# EAGLE design Adafruit SPI Flash SD Card (EAGLE 9.6.2)
COMPANY: Adafruit Industries; DRAWN: KTOWN; REV: A; YEAR: 2018
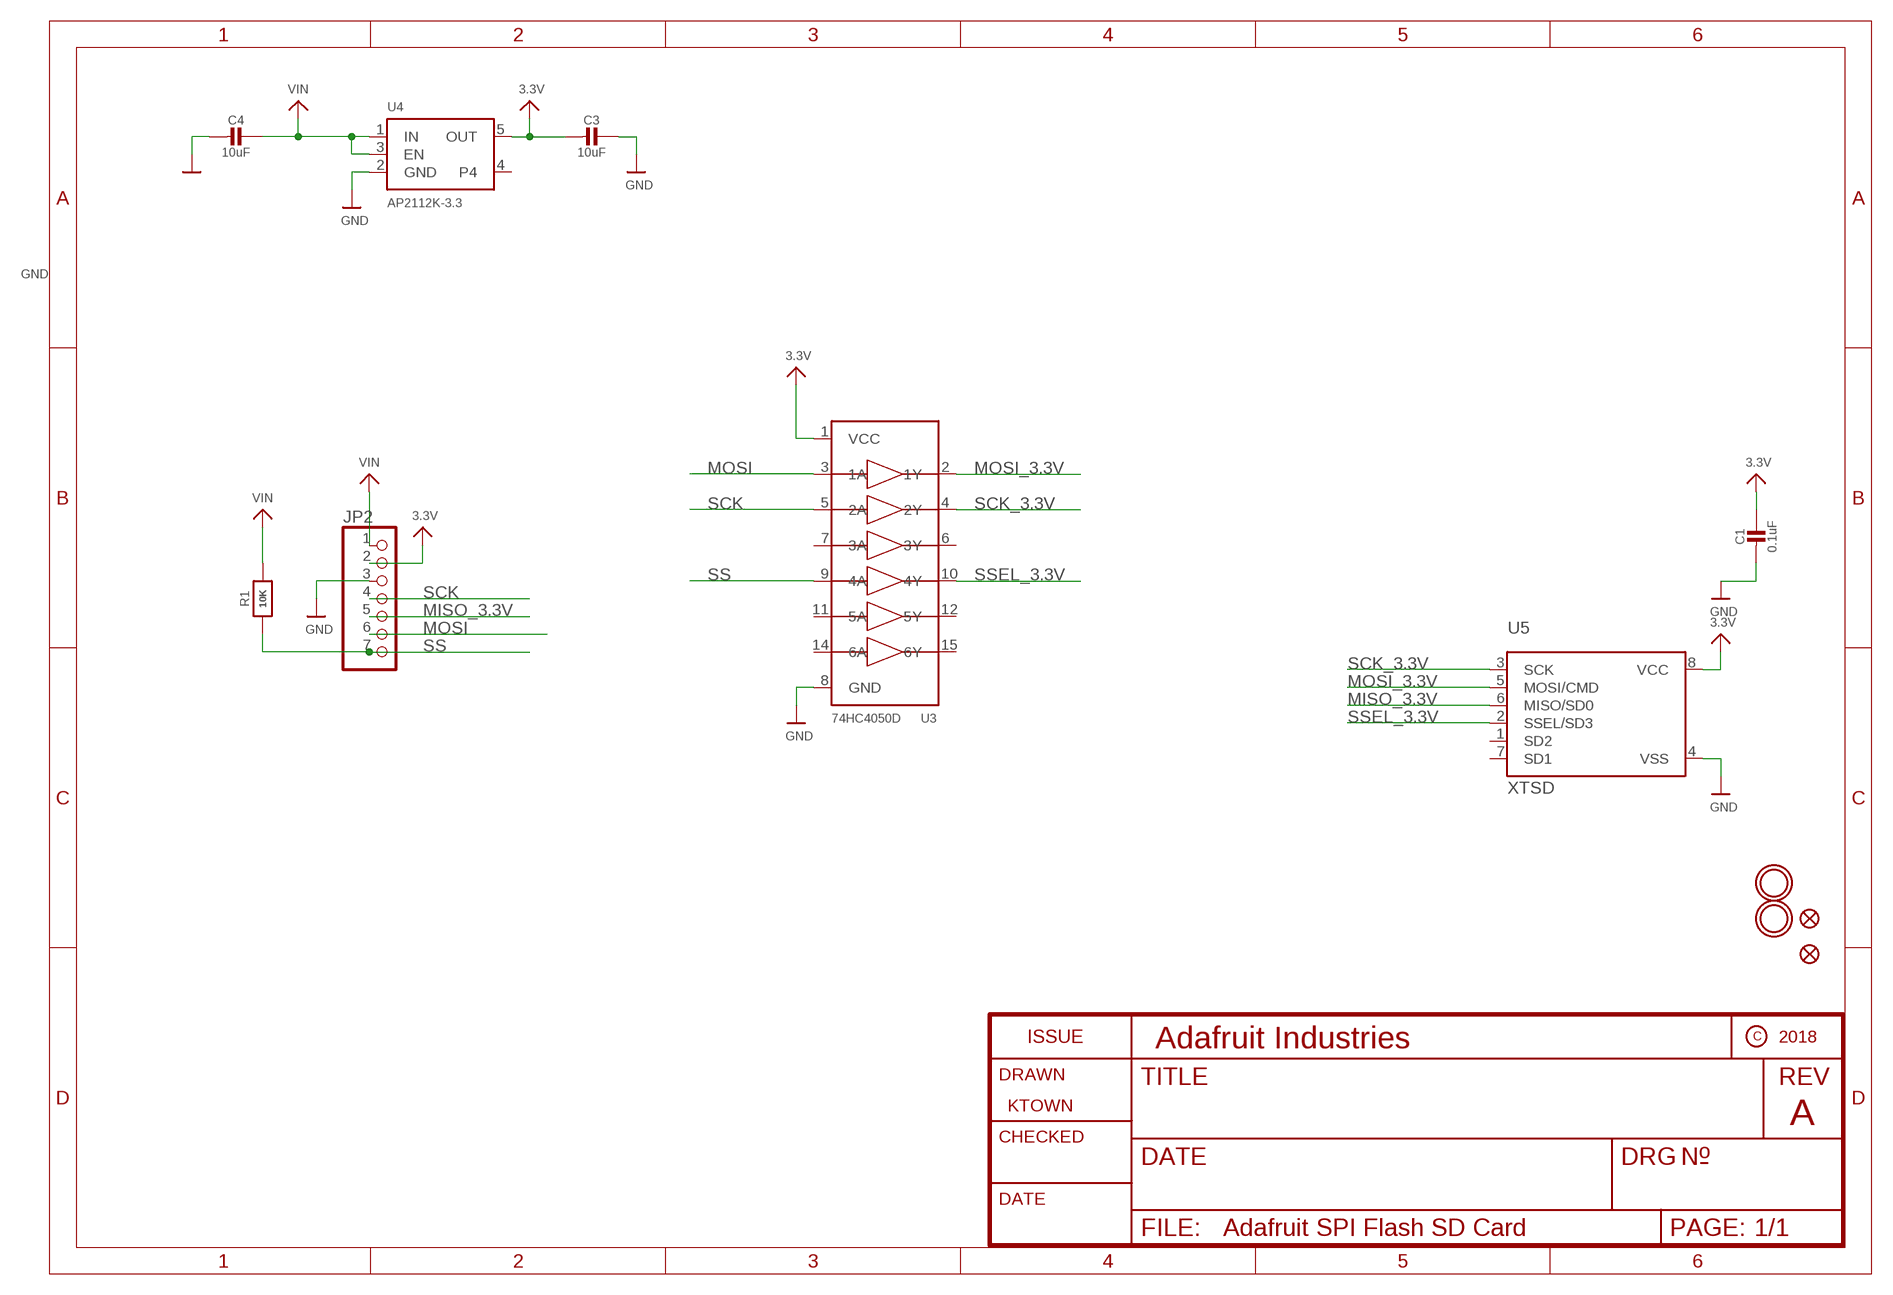
[diagram p0: schematic, sheet 1]

## Parts
C1  0.1uF  CAP_CERAMIC0603_NO  [0603-NO]
C3  10uF  CAP_CERAMIC0805-NOOUTLINE  [0805-NO]
C4  10uF  CAP_CERAMIC0805-NOOUTLINE  [0805-NO]
FID2  FIDUCIAL_1MM  [FIDUCIAL_1MM]
FID3  FIDUCIAL_1MM  [FIDUCIAL_1MM]
JP2  HEADER-1X770MIL  [1X07_ROUND_70]
R1  10K  RESISTOR_0603_NOOUT  [0603-NO]
U3  74HC4050D  74HC4050DTSSOP  [TSSOP16]
U4  AP2112K-3.3  VREG_SOT23-5  [SOT23-5]
U5  XTSD  SMT_SDCARD_8PIN  [LGA8_8X6]
U$16  MOUNTINGHOLE2.5  [MOUNTINGHOLE_2.5_PLATED]
U$17  MOUNTINGHOLE2.5  [MOUNTINGHOLE_2.5_PLATED]

## Nets
3.3V: C1.1 C3.2 JP2.2 U3.1(VCC) U4.5(OUT) U5.8(VCC)
GND: C1.2 C3.1 C4.2 JP2.3 U3.8(GND) U4.2(GND) U5.4(VSS)
MISO_3.3V: JP2.5 U5.6(MISO/SD0)
MOSI: JP2.6 U3.3(1A)
MOSI_3.3V: U3.2(1Y) U5.5(MOSI/CMD)
SCK: JP2.4 U3.5(2A)
SCK_3.3V: U3.4(2Y) U5.3(SCK)
SS: JP2.7 R1.1 U3.9(4A)
SSEL_3.3V: U3.10(4Y) U5.2(SSEL/SD3)
VIN: C4.1 JP2.1 R1.2 U4.1(IN) U4.3(EN)
Unconnected: U3.6(3Y) U3.7(3A) U3.11(5A) U3.12(5Y) U3.14(6A) U3.15(6Y) U4.4 U5.1(SD2) U5.7(SD1)

## Library data of the parts
C1 C3 C4 = microbuilder:CAP_CERAMIC: Ceramic Capacitors For new designs, use the packages preceded by an '_' character since they are more reliable: The following footprints should be used on most boards: _0402 - Standard footprint for regular board layouts _0603 - Standard footprint for regular board layouts _0805 - Standard footprint for regular board layouts _1206 - Standard footprint for regular board layouts For extremely tight-pitch boards where space is at a premium, the following 'micro-pitch' footprints can be used (smaller pads, no silkscreen outline, etc.): _0402MP - Micro-pitch footprint for very dense/compact boards _0603MP - Micro-pitch footprint for very dense/compact boards _0805MP - Micro-pitch footprint for very dense/compact boards _1206MP - Micro-pitch footprint for very dense/compact boards
FID2 FID3 = microbuilder:FIDUCIAL: Fiducial Alignment Points Various fiducial points for machine vision alignment.; BOM: EXCLUDE
JP2 = microbuilder:HEADER-1X7: PIN HEADER
R1 = microbuilder:RESISTOR: Resistors For new designs, use the packages preceded by an '_' character since they are more reliable: The following footprints should be used on most boards: _0402 - Standard footprint for regular board layouts _0603 - Standard footprint for regular board layouts _0805 - Standard footprint for regular board layouts _1206 - Standard footprint for regular board layouts For extremely tight-pitch boards where space is at a premium, the following 'micro-pitch' footprints can be used (smaller pads, no silkscreen outline, etc.): _0402MP - Micro-pitch footprint for very dense/compact boards _0603MP - Micro-pitch footprint for very dense/compact boards _0805MP - Micro-pitch footprint for very dense/compact boards _1206MP - Micro-pitch footprint for very dense/compact boards
U3 = microbuilder:74HC4050D: 6-channel level shifter 74HC4050D - 2V-6V Supply SOIC16 Digikey: 74HC4050D,653-ND Mouser: 771-74HC4050D-T TSSOP16 Digikey: 296-9215-1-ND Mouser:
U4 = microbuilder:VREG_SOT23-5: SOT23-5 Fixed Voltage Regulators Part Current Out V Out V In V Dropout θJA (°C/W) TJ (°C) Digikey Part No. ADP121 150mA 3.3V 3.4-5.5V 0.09V @ 150mA -- -- ADP121-AUJZ33R7CT-ND ADP121 150mA 3.0V 3.1-5.5V 0.09V @ 150mA -- -- ADP121-AUJZ30R7CT-ND ADP122 300mA 3.3V 3.4-5.5V 0.085V @ 300mA -- -- ADP122AUJZ-3.3-R7CT-ND ADP1712 300mA 3.3V 3.5-5.5V 0.17V @ 300mA -- -- ADP1712AUJZ-3.3-R7TR-ND AP7311 (Low Cost) 150mA 3.3V 3.5-6V 0.15V @ 150mA -- -- AP7311-33WG-7DICT-ND LD39015M18R 150mA 1.8V 1.9V-5.5V 0.08V @ 100mA -- -- 497-6977-1-ND LP2985A-33DBVR 150mA 3.3V 3.3-16V 0.28V @ 150mA 206 150 296-18479-1-ND MCP1824T-3302E/OT 300mA 3.3V 3.5V-6V 0.2V @ 300mA -- -- MCP1824T-3302E/OTCT-ND MIC5205-2.5YM5 TR 150mA 2.5V 2.7-16V 0.165V @ 150mA -- -- 576-1257-2-ND MIC5205-3.0YM5 TR 150mA 3.0V 3.2V-16V 0.165V @ 150mA -- -- 576-1258-2-ND MIC5205-3.3YM5 TR 150mA 3.3V 3.5V-16V 0.165V @ 150mA -- -- 576-1259-2-ND TPS780330220 150mA 3.3V+2.2V 3.6-5.5V 250mV Max -- -- 296-23332-1-ND TDA3663/N1,135 100mA 3.3V 3.5-45V 0.18V @ 50mA -- -- 568-5343-1-ND Max operating temp can be calculated using θJA, TJ (max junction temperature), and power in watts. Set the "Maximum Ambient Temperature" until it reaches TJ ("Max Junction Temperature"), which is the absolute limit for safe use of the regulator: Heat Sink Temperature Calculator <http://www.daycounter.com/Calculators/Heat-Sink-Temperature-Calculator.phtml> For example, With 12V source into a 3.3V LP2985 and a 30mA load, we are dissipating (12V-3.3V) * 0.03A = 0.261W. With a θJA of 206 °C/W, a TJ of 150°C, and 261mW we can safely use the chip without a heat sink up to 75°C (=147.1°C Junction Temperature).
U5 = microbuilder:SMT_SDCARD_8PIN: SOIC8 SPI Flash Be careful with the size since SOIC8 flash comes in several 'widths' SOIC8 150 mil M25P16 - 16Mbit (2Mbit x 8) Serial Flash (75MHz SPI Bus), Supply: 2.7-3.6V Digikey: SOIC8 - M25P16-VMN6P-ND SOIC8 208 mil W25Q16BVSSIG - 16Mbit (2Mbit x 8) Serial Flash (104MHz SPI Bus), Supply: 2.7-3.6V Digikey: SOIC8 - W25Q16BVSSIG-ND
U$16 U$17 = microbuilder:MOUNTINGHOLE: Mounting Hole For #2 screws (0.086"/2.18mm width, 0.094"/2.4mm hole) use 2.5mm; BOM: EXCLUDE

## Board
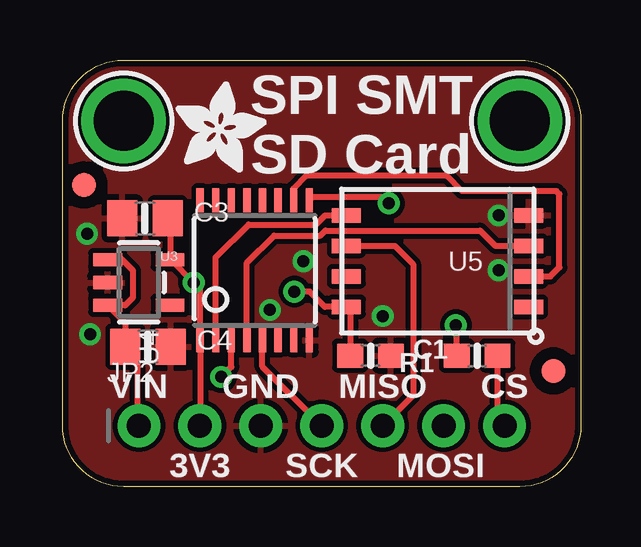
[diagram p1: board, top side]
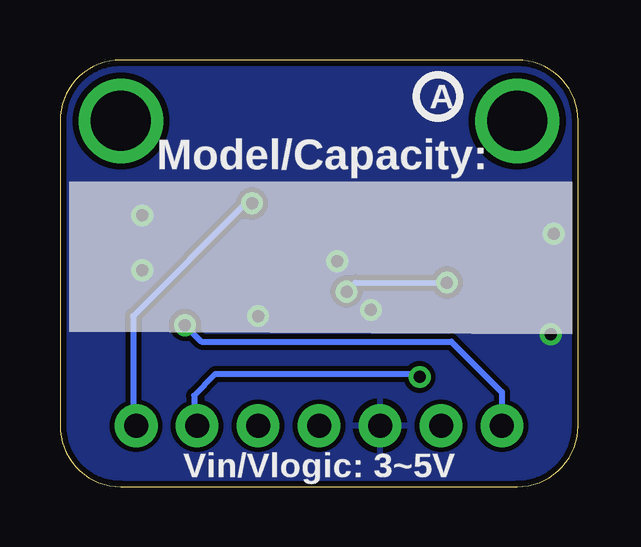
[diagram p2: board, bottom side, seen from below]

Size 21.59 x 17.78 mm. Coordinates in mm from the lower left corner, seen from the top.
Outline: 0,2.54 0,15.24 arc-90 2.54,17.78 19.05,17.78 arc-90 21.59,15.24 21.59,2.54 arc-90 19.05,0 2.54,0 arc-90 0,2.54
Copper layers (1*16): Top 0.035mm / dielectric 1.5mm / Bottom 0.035mm
Design rules "adafruit": minimum track width 8mil, minimum drill 15.5mil, track to track 8mil, track to pad 8mil, pad to pad 8mil, via to via 8mil, smd to smd 8mil, copper to edge 10mil, drill to drill 8mil, minimum pad ring 10mil, minimum via ring 8mil, stop-mask expansion 2mil, vias tented up to drill 20mil, thermal gap 10mil

### Footprints (pad centres in the part's own frame; a part is rotated, then mirrored left to right if it is on the bottom)
0603-NO = smd 1.075 x 1: 1 -0.85,0; 2 0.85,0
0805-NO = smd 1.24 x 1.5: 1 -0.95,0; 2 0.95,0
FIDUCIAL_1MM = smd 1 x 1: 1 0,0
1X07_ROUND_70 = drill 1 pad 1.778: 1 -7.62,0; 2 -5.08,0; 3 -2.54,0; 4 0,0; 5 2.54,0; 6 5.08,0; 7 7.62,0
TSSOP16 = smd 0.305 x 0.991: 1 -2.275,-2.918; 2 -1.625,-2.918; 3 -0.975,-2.918; 4 -0.325,-2.918; 5 0.325,-2.918; 6 0.975,-2.918; 7 1.625,-2.918; 8 2.275,-2.918; 9 2.275,2.918; 10 1.625,2.918; 11 0.975,2.918; 12 0.325,2.918; 13 -0.325,2.918; 14 -0.975,2.918; 15 -1.625,2.918; 16 -2.275,2.918
SOT23-5 = smd 0.55 x 1.2: 1 -0.95,-1.3; 2 0,-1.3; 3 0.95,-1.3; 4 0.95,1.3; 5 -0.95,1.3
LGA8_8X6 = smd 1.2 x 0.6: 1 -3.8,1.905; 2 -3.8,0.635; 3 -3.8,-0.635; 4 -3.8,-1.905; 5 3.8,-1.905; 6 3.8,-0.635; 7 3.8,0.635; 8 3.8,1.905
MOUNTINGHOLE_2.5_PLATED = drill 2.5 pad 3.2: P$1 0,0

### Placement (x,y rotation side)
C1  12.83,5.46 0 top
C3  3.43,11.18 0 top
C4  3.56,5.84 0 top
FID2  0.89,12.57 0 top
FID3  20.45,4.83 0 top
JP2  10.79,2.54 0 top
R1  17.27,5.46 180 top
U3  8,9.02 0 top
U4  3.17,8.51 270 top
U5  15.62,9.4 180 top
U$16  2.54,15.24 0 top
U$17  19.05,15.24 0 top
U$19  [ADAFRUIT_3.5MM]  4.7,13.08 0 top
U$21  [PCBFEAT-REV-040]  5.84,16.26 0 bottom

### Tracks (layer width: path | path; a pad name or v marks a point on that pad's centre or on a via)
3.3V  (via drill 0.5)
  Top 0.254: C1.1 11.98,7.34 U5.8 10.92,7.49 10.29,8.13 v9.65,8.13 | JP2.2 5.73,2.55 U3.1 5.73,8.25 v5.47,8.51 4.52,9.46 U4.5 4.47,11.08 C3.2
  Bottom 0.254: v9.65,8.13 9.27,8.51 v5.47,8.51
GND  (via drill 0.5)
  other vias: 18.16,11.3 13.34,7.11 8.64,7.37 10.03,9.4 18.16,9.02 1.02,10.54 1.14,6.35
  pour Top: 21.59,17.78 21.59,0 0,0 0,17.78 0.06,17.84
  pour Bottom: 0,17.91 21.72,17.91 21.72,0.13 0,0 0,0.13
MISO_3.3V
  Top 0.254: U5.6 13.84,10.03 14.61,9.27 14.61,3.81 JP2.5
MOSI  (via drill 0.5)
  Top 0.254: v6.6,4.57 7.03,4.99 U3.3
  Bottom 0.254: JP2.6 16,2.67 16,3.81 15.11,4.7 6.73,4.7 v6.6,4.57
MOSI_3.3V
  Top 0.254: U3.2 6.38,9.55 7.75,10.92 10.55,10.92 10.93,11.3 U5.5
SCK
  Top 0.254: JP2.4 8.33,5.01 U3.5
SCK_3.3V
  Top 0.254: U3.4 7.68,9.33 8.81,10.46 10.74,10.46 10.94,10.67 17.4,10.67 18.03,10.03 U5.3
SS  (via drill 0.5)
  Top 0.254: JP2.7 18.54,2.67 18.12,3.09 R1.1 | v13.59,11.81 13.34,12.06 10.41,12.06 U3.9
  Bottom 0.254: JP2.7 18.54,2.67 18.54,7.11 13.84,11.81 v13.59,11.81
SSEL_3.3V
  Top 0.254: U5.2 20.32,8.76 20.7,9.14 20.7,12.19 20.57,12.32 16.64,12.32 16,12.95 10.16,12.95 9.63,12.42 U3.10
VIN  (via drill 0.5)
  Top 0.254: U4.1 2.48,9.46 2.92,9.02 2.92,7.87 2.61,7.56 U4.3 2.61,6.83 C4.1 3.11,5.33 3.11,2.6 JP2.1 | R1.2 16.42,6.69 v16.38,6.73
  Bottom 0.254: v16.38,6.73 15.7,6.04 5.28,6.04 3.17,3.94 JP2.1

### Text on the board
tPlace: SPI SMT / SD Card | VIN | GND | MISO | CS | 3V3 | SCK | MOSI
bPlace: Model/Capacity: | Vin/Vlogic: 3~5V